# Altium project Shuttler_AFE.PrjPCB
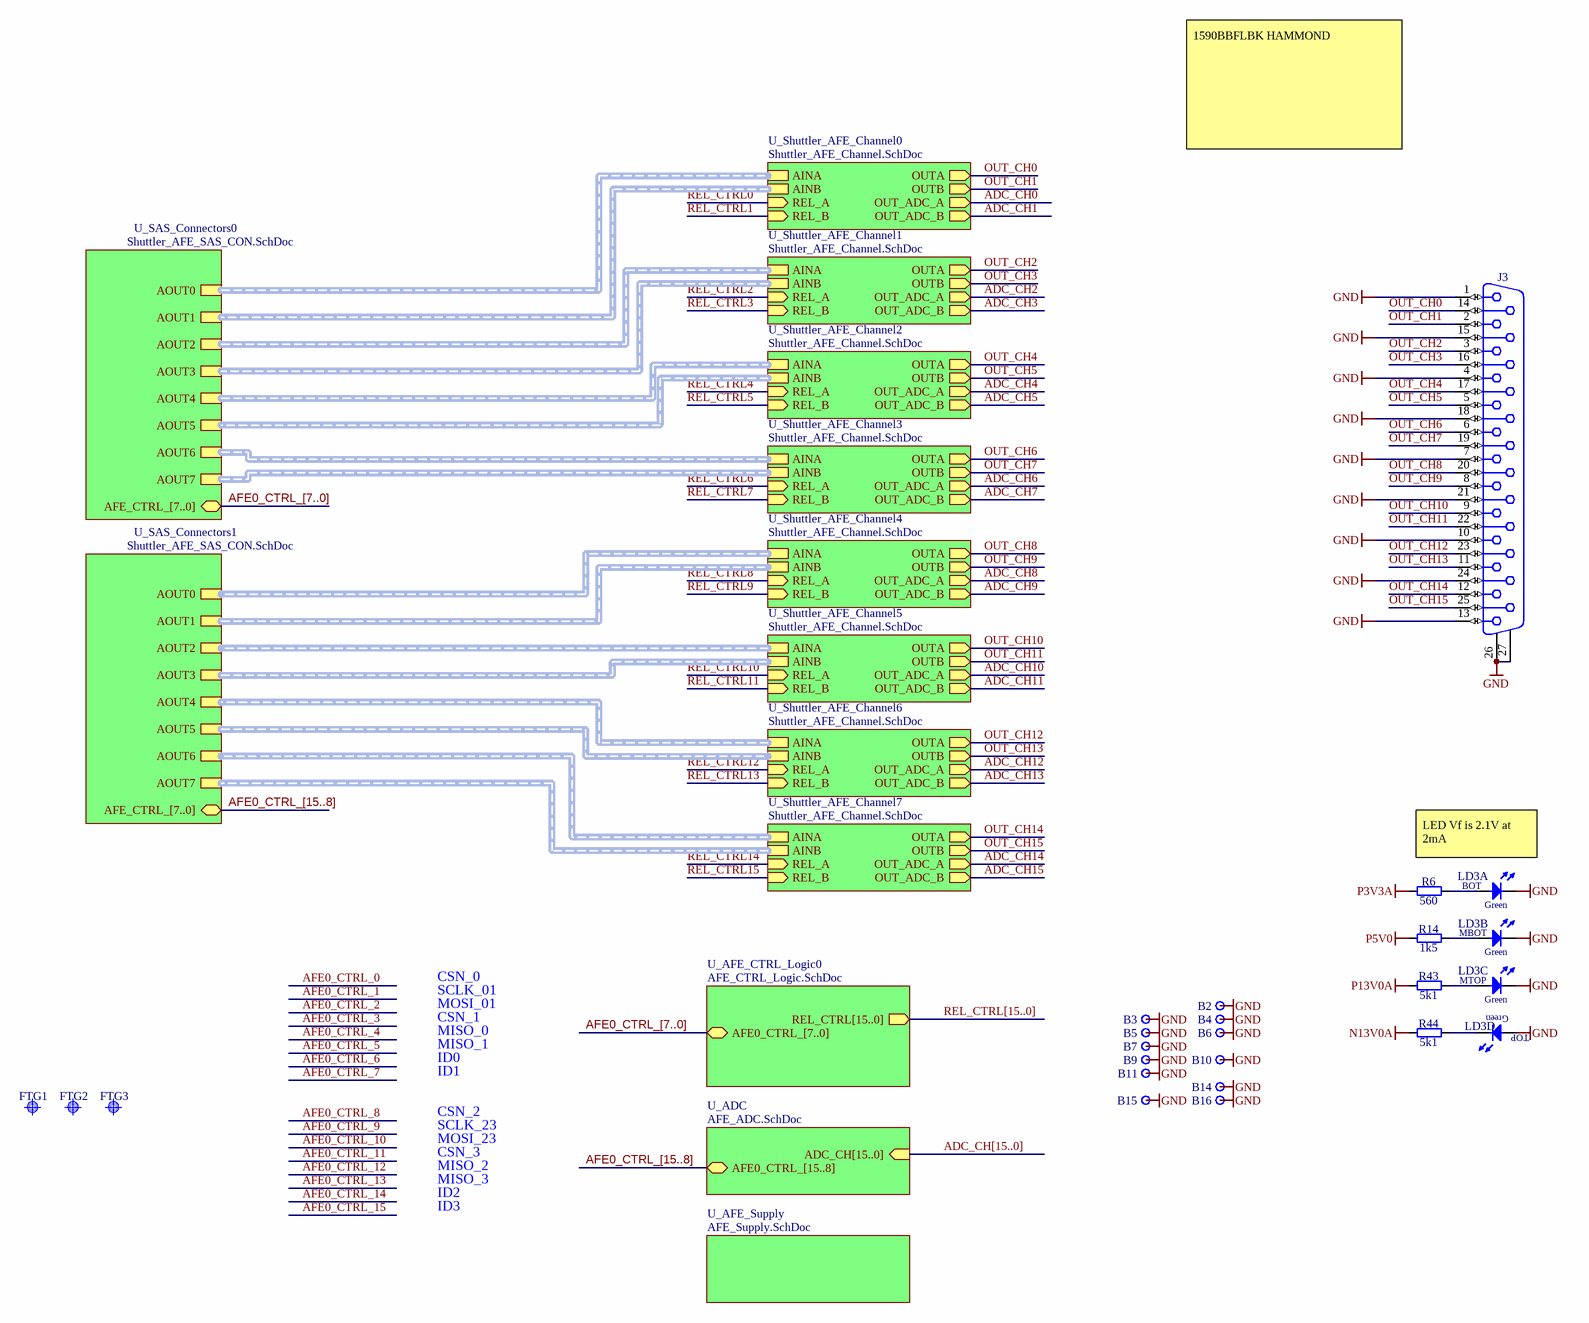
[diagram p0: Shuttler_AFE.SchDoc]
P_version: 1.3
3 sheets, 112 parts. Net scope: hierarchical (ports join the sheet entries above them; power ports are global).
Board file: Shuttler_AFE.PcbDoc
Sheets:
  Shuttler_AFE.SchDoc
    U_AFE_CTRL_Logic0 = AFE_CTRL_Logic.SchDoc
    U_ADC = AFE_ADC.SchDoc

## Sheet Shuttler_AFE.SchDoc: Shuttler AFE
size 420 x 297 mm; Author: G.Kasprowicz; CompanyName: WUT ISE; DrawnBy: G.Kasprowicz; Organization: WUT ISE; Address1: PW ISE; Address2: Nowowiejska 15/19 00-665 Warsaw; Address3: gkasprow@gmail.com; DocumentNumber: 1; Revision: 1.3; SheetNumber: 1; SheetTotal: 6; ModifiedBy: -; CheckedDate: -; Title2: TOP; DivGrp: WUT ISE; Designer: G.Kasprowicz; ModifiedDate: -; ProjectName: Sensor Box

### Parts
B2  Plated Hole  [MTG270_500]  (value not drawn)  (no BOM)
B3  Plated Hole  [MTG270_500]  (value not drawn)  (no BOM)
B4  Plated Hole  [MTG270_500]  (value not drawn)  (no BOM)
B5  Plated Hole  [MTG270_500]  (value not drawn)  (no BOM)
B6  Plated Hole  [MTG270_500]  (value not drawn)  (no BOM)
B7  Plated Hole  [MTG270_500]  (value not drawn)  (no BOM)
B9  Plated Hole  [MTG270_500]  (value not drawn)  (no BOM)
B10  Plated Hole  [MTG270_500]  (value not drawn)  (no BOM)
B11  Plated Hole  [MTG270_500]  (value not drawn)  (no BOM)
B14  Plated Hole  [MTG270_500]  (value not drawn)  (no BOM)
B15  Plated Hole  [MTG270_500]  (value not drawn)  (no BOM)
B16  Plated Hole  [MTG270_500]  (value not drawn)  (no BOM)
FTG1  Use only in PCB  [FIDUCIAL_TOP_S100-200]  (value not drawn)
FTG2  Use only in PCB  [FIDUCIAL_TOP_S100-200]  (value not drawn)
FTG3  Use only in PCB  [FIDUCIAL_TOP_S100-200]  (value not drawn)
J3  D-Sub  [TYCO_3-1634586-2]  (value not drawn)
LD3  Green  [LED_BIVAR_H485CGDL]  (value not drawn)  (parts A,B,C,D of 4)
R6  560  [RESC1608X55N]
R14  1k5  [RESC1608X55N]
R43  5k1  [RESC1608X55N]
R44  5k1  [RESC1608X55N]

### Sub-sheets
U_ADC = AFE_ADC.SchDoc: ADC_CH[15..0] (in), AFE0_CTRL_[15..8] (bidir)
U_AFE_CTRL_Logic0 = AFE_CTRL_Logic.SchDoc: REL_CTRL[15..0] (out), AFE0_CTRL_[7..0] (bidir)
U_AFE_Supply = AFE_Supply.SchDoc (file not in this document): no entries
U_SAS_Connectors0 = Shuttler_AFE_SAS_CON.SchDoc (file not in this document): AOUT4 (harness DIFF), AOUT0 (harness DIFF), AOUT1 (harness DIFF), AOUT2 (harness DIFF), AOUT6 (harness DIFF), AOUT7 (harness DIFF), AFE_CTRL_[7..0] (bidir), AOUT3 (harness DIFF), AOUT5 (harness DIFF)
U_SAS_Connectors1 = Shuttler_AFE_SAS_CON.SchDoc (file not in this document): AOUT4 (harness DIFF), AOUT0 (harness DIFF), AOUT1 (harness DIFF), AOUT2 (harness DIFF), AOUT6 (harness DIFF), AOUT7 (harness DIFF), AFE_CTRL_[7..0] (bidir), AOUT3 (harness DIFF), AOUT5 (harness DIFF)
U_Shuttler_AFE_Channel0 = Shuttler_AFE_Channel.SchDoc (file not in this document): AINA (harness DIFF), OUTA (out), AINB (harness DIFF), OUTB (out), REL_A (in), REL_B (in), OUT_ADC_A (out), OUT_ADC_B (out)
U_Shuttler_AFE_Channel1 = Shuttler_AFE_Channel.SchDoc (file not in this document): AINA (harness DIFF), OUTA (out), AINB (harness DIFF), OUTB (out), REL_A (in), REL_B (in), OUT_ADC_A (out), OUT_ADC_B (out)
U_Shuttler_AFE_Channel2 = Shuttler_AFE_Channel.SchDoc (file not in this document): AINA (harness DIFF), OUTA (out), AINB (harness DIFF), OUTB (out), REL_A (in), REL_B (in), OUT_ADC_A (out), OUT_ADC_B (out)
U_Shuttler_AFE_Channel3 = Shuttler_AFE_Channel.SchDoc (file not in this document): AINA (harness DIFF), OUTA (out), AINB (harness DIFF), OUTB (out), REL_A (in), REL_B (in), OUT_ADC_A (out), OUT_ADC_B (out)
U_Shuttler_AFE_Channel4 = Shuttler_AFE_Channel.SchDoc (file not in this document): AINA (harness DIFF), OUTA (out), AINB (harness DIFF), OUTB (out), REL_A (in), REL_B (in), OUT_ADC_A (out), OUT_ADC_B (out)
U_Shuttler_AFE_Channel5 = Shuttler_AFE_Channel.SchDoc (file not in this document): AINA (harness DIFF), OUTA (out), AINB (harness DIFF), OUTB (out), REL_A (in), REL_B (in), OUT_ADC_A (out), OUT_ADC_B (out)
U_Shuttler_AFE_Channel6 = Shuttler_AFE_Channel.SchDoc (file not in this document): AINA (harness DIFF), OUTA (out), AINB (harness DIFF), OUTB (out), REL_A (in), REL_B (in), OUT_ADC_A (out), OUT_ADC_B (out)
U_Shuttler_AFE_Channel7 = Shuttler_AFE_Channel.SchDoc (file not in this document): AINA (harness DIFF), OUTA (out), AINB (harness DIFF), OUTB (out), REL_A (in), REL_B (in), OUT_ADC_A (out), OUT_ADC_B (out)

### Nets
GND: B2.1 B3.1 B4.1 B5.1 B6.1 B7.1 B9.1 B10.1 B11.1 B14.1 B15.1 B16.1 J3.1 J3.4 J3.7 J3.10 J3.13 J3.15 J3.18 J3.21 J3.24 J3.26 J3.27 LD3.1(C) LD3.3(C) LD3.5(C) LD3.8(A)
N13V0A: R44.1
P3V3A: R6.1
P5V0: R14.1
P13V0A: R43.1
OUT_CH0: J3.14 ; sheet U_Shuttler_AFE_Channel0/OUTA
OUT_CH1: J3.2 ; sheet U_Shuttler_AFE_Channel0/OUTB
OUT_CH2: J3.3 ; sheet U_Shuttler_AFE_Channel1/OUTA
OUT_CH3: J3.16 ; sheet U_Shuttler_AFE_Channel1/OUTB
OUT_CH4: J3.17 ; sheet U_Shuttler_AFE_Channel2/OUTA
OUT_CH5: J3.5 ; sheet U_Shuttler_AFE_Channel2/OUTB
OUT_CH6: J3.6 ; sheet U_Shuttler_AFE_Channel3/OUTA
OUT_CH7: J3.19 ; sheet U_Shuttler_AFE_Channel3/OUTB
OUT_CH8: J3.20 ; sheet U_Shuttler_AFE_Channel4/OUTA
OUT_CH9: J3.8 ; sheet U_Shuttler_AFE_Channel4/OUTB
OUT_CH10: J3.9 ; sheet U_Shuttler_AFE_Channel5/OUTA
OUT_CH11: J3.22 ; sheet U_Shuttler_AFE_Channel5/OUTB
OUT_CH12: J3.23 ; sheet U_Shuttler_AFE_Channel6/OUTA
OUT_CH13: J3.11 ; sheet U_Shuttler_AFE_Channel6/OUTB
OUT_CH14: J3.12 ; sheet U_Shuttler_AFE_Channel7/OUTA
OUT_CH15: J3.25 ; sheet U_Shuttler_AFE_Channel7/OUTB
NetLD3_2: LD3.2(A) R6.2
NetLD3_4: LD3.4(A) R14.2
NetLD3_6: LD3.6(A) R43.2
NetLD3_7: LD3.7(C) R44.2

### Buses and harness runs
bus ADC_CH[15..0] = sheet U_ADC/ADC_CH[15..0]
bus AFE0_CTRL_[7..0] = sheet U_AFE_CTRL_Logic0/AFE0_CTRL_[7..0]
bus AFE0_CTRL_[7..0] = sheet U_SAS_Connectors0/AFE_CTRL_[7..0]
bus AFE0_CTRL_[15..8] = sheet U_ADC/AFE0_CTRL_[15..8]
bus AFE0_CTRL_[15..8] = sheet U_SAS_Connectors1/AFE_CTRL_[7..0]
bus REL_CTRL[15..0] = sheet U_AFE_CTRL_Logic0/REL_CTRL[15..0]
harness sheet U_SAS_Connectors0/AOUT0 = sheet U_Shuttler_AFE_Channel0/AINA
harness sheet U_SAS_Connectors0/AOUT1 = sheet U_Shuttler_AFE_Channel0/AINB
harness sheet U_SAS_Connectors0/AOUT2 = sheet U_Shuttler_AFE_Channel1/AINA
harness sheet U_SAS_Connectors0/AOUT3 = sheet U_Shuttler_AFE_Channel1/AINB
harness sheet U_SAS_Connectors0/AOUT4 = sheet U_Shuttler_AFE_Channel2/AINA
harness sheet U_SAS_Connectors0/AOUT5 = sheet U_Shuttler_AFE_Channel2/AINB
harness sheet U_SAS_Connectors0/AOUT6 = sheet U_Shuttler_AFE_Channel3/AINA
harness sheet U_SAS_Connectors0/AOUT7 = sheet U_Shuttler_AFE_Channel3/AINB
harness sheet U_SAS_Connectors1/AOUT0 = sheet U_Shuttler_AFE_Channel4/AINA
harness sheet U_SAS_Connectors1/AOUT1 = sheet U_Shuttler_AFE_Channel4/AINB
harness sheet U_SAS_Connectors1/AOUT2 = sheet U_Shuttler_AFE_Channel5/AINA
harness sheet U_SAS_Connectors1/AOUT3 = sheet U_Shuttler_AFE_Channel5/AINB
harness sheet U_SAS_Connectors1/AOUT4 = sheet U_Shuttler_AFE_Channel6/AINA
harness sheet U_SAS_Connectors1/AOUT5 = sheet U_Shuttler_AFE_Channel6/AINB
harness sheet U_SAS_Connectors1/AOUT6 = sheet U_Shuttler_AFE_Channel7/AINA
harness sheet U_SAS_Connectors1/AOUT7 = sheet U_Shuttler_AFE_Channel7/AINB

### Notes on the sheet
- 1590BBFLBK HAMMOND
- LED Vf is 2.1V at 2mA
- CSN_0
- SCLK_01
- MISO_0
- CSN_1
- MISO_1
- ID0
- MOSI_01
- ID1
- CSN_2
- SCLK_23
- MOSI_23
- MISO_2
- CSN_3
- MISO_3
- ID2
- ID3
- Project/Equipment
- Document
- Designer
- Drawn by
- Check.by
- Copyright WUT ISE 2018.
  This documentation describes Open Hardware and is licensed under the CERN OHL v.1.1. You may redistribute and modify this documentation under the terms of the CERN OHL v.1.1. (http://ohwr.org/CERNOHL). This documentation is distributed WITHOUT ANY EXPRESS OR IMPLIED WARRANTY, INCLUDING OF MERCHANTABILITY, SATISFACTORY QUALITY AND FITNESS FOR A PARTICULAR PURPOSE. Please see the CERN OHL v.1.1 for applicable conditions.
- Contact
- File
- Last Mod.
- Print Date
- Sheet
- Size
- A3
- of
- Rev
- (in symbol LED_BIVAR_H485CGDL, part A) BOT
- (in symbol LED_BIVAR_H485CGDL, part B) MBOT
- (in symbol LED_BIVAR_H485CGDL, part C) MTOP
- (in symbol LED_BIVAR_H485CGDL, part D) TOP

### Library data of the parts
B2-B7 B9-B11 B14-B16 = PLATED_HOLE2.7_PAD5.0: Single Terminal Socket; Part Description: Plated Through Hole: Hole Dia.=2.7mm Pad Dia.=5.0mm; Mounted: No; Part Number: PLATED_HOLE2.7_PAD5.0; Component Type: Standard (No BOM); Pin Count: 1; Family: Plated Hole; Socket: No; SMD: No; Sense: No; Status: None; ComponentHeight: 0mm; HelpURL: Undefined; Author: CERN DEM JMW; CreateDate: 27.09.2011; LatestRevisionDate: 27.09.2011; PackageDescription: Plated Through Hole: Hole Dia.=2.7mm Pad Dia.=5.0mm
FTG1-FTG3 = FIDUCIAL_TARGET_S100-200: Fiducial Target; Part Description: Square Fiducial Target, Top Layer, 1.0mm, Top Solder 2.0mm, Keepout =2.0mm; Mounted: No; Table: Pads; Part Number: FIDUCIAL_TARGET_S100-200; Component Kind: Standard (No BOM); Component Type: Standard (No BOM); Pin Count: 1; Family: Fiducial; Socket: No; SMD: Yes; Status: None; ComponentHeight: 0mm; Author: CERN DEM JLC; CreateDate: 9/2/2010; LatestRevisionDate: 4/4/2012; PackageDescription: Square Fiducial Target, Top Layer, 1.0mm, Top Solder 2.0mm, Keepout =2.0mm
J3 = TYCO_3-1634586-2: Connector D-sub 25 Female; Part Description: Right Angle 25 Female Contacts D-SUB Connector With Boardlock and 4-40 UNC Screwlocks; Manufacturer: TYCO ELECTRONICS; PressFit: No; Part Number: TYCO_3-1634586-2; Component Kind: Standard; Component Type: Standard; Pin Count: 27; Family: D-Sub; Mounted: Yes; Socket: No; SMD: No; Sense: No; Status: None; Manufacturer Part Number: 3-1634586-2; ComponentHeight: 13.57mm; HelpURL: \\cern.ch\dfs\Applications\Altium\Datasheets\TYCO_3-1634586-2.pdf; Author: CERN DEM JLC; CreateDate: 16.01.2013; LatestRevisionDate: 16.01.2013
LD3 = LED_BIVAR_H485CGDL: LED x4 Green 1C2A-BOT_3C4A_5C6A_7C8A-TOP; Part Description: Quad-Level 2mm Green LED, PCB Edge Mounting; Manufacturer: BIVAR; PressFit: No; Bonding: No; Part Number: LED_BIVAR_H485CGDL; Component Kind: Standard; Component Type: Standard; Color: Green; PackageDescription: Quad-Level 2mm Green, PCB Edge Mounting  BIVAR H485CHDL; Manufacturer Part Number: H485CGDL; Pin Count: 8; Mounted: Yes; Socket: No; SMD: No; Sense: No; ComponentHeight: 11.3mm; HelpURL: \\cern.ch\dfs\Applications\Altium\Datasheets\LED_BIVAR_H485CGDL.pdf; Author: CERN DEM JLC; CreateDate: 04.06.2012; LatestRevisionDate: 04.06.2012
R6 = R0603_560R_1%_0.1W_100PPM: Resistor - 1%; Part Description: General Purpose Thick Film Chip Resistor; Manufacturer: GENERIC; Manufacturer1 Part Number: NRC06F5600TRF; Power: 0.1W; TC: ±100ppm/°C; PressFit: No; Part Number: R0603_560R_1%_0.1W_100PPM; Component Kind: Standard; Component Type: Standard; Pin Count: 2; Value: 560; Status: Preferred; Tolerance: ±1%; Manufacturer Part Number: R0603_560R_1%_0.1W_100PPM; Case: 0603; Mounted: Yes; Sense: No; Socket: No; SMD: Yes; Manufacturer1 Example: NIC COMPONENT; Manufacturer1 ComponentHeight: 0.55mm; HelpURL: \\cern.ch\dfs\Applications\Altium\Datasheets\R0603_NIC_NRC.pdf; Author: CERN DEM JLC; CreateDate: 03.12.2007; LatestRevisionDate: 13.03.2008
R14 = R0603_1K5_1%_0.1W_100PPM: Resistor - 1%; Part Description: General Purpose Thick Film Chip Resistor; Manufacturer: GENERIC; Manufacturer1 Part Number: NRC06F1501TRF; Power: 0.1W; TC: ±100ppm/°C; PressFit: No; Part Number: R0603_1K5_1%_0.1W_100PPM; Component Kind: Standard; Component Type: Standard; Pin Count: 2; Value: 1k5; Status: Preferred; Tolerance: ±1%; Manufacturer Part Number: R0603_1K5_1%_0.1W_100PPM; Case: 0603; Mounted: Yes; Sense: No; Socket: No; SMD: Yes; Manufacturer1 Example: NIC COMPONENT; Manufacturer1 ComponentHeight: 0.55mm; HelpURL: \\cern.ch\dfs\Applications\Altium\Datasheets\R0603_NIC_NRC.pdf; Author: CERN DEM JLC; CreateDate: 03.12.2007; LatestRevisionDate: 13.03.2008
R43 R44 = R0603_5k1_1%_0.1W_100PPM: Resistor - 1%; Part Description: General Purpose Thick Film Chip Resistor; Manufacturer: GENERIC; Manufacturer1 Part Number: NRC06F5101TRF; Power: 0.1W; TC: ±100ppm/°C; PressFit: No; Part Number: R0603_5K1_1%_0.1W_100PPM; Component Kind: Standard; Component Type: Standard; Pin Count: 2; Value: 5k1; Status: Preferred; Tolerance: ±1%; Manufacturer Part Number: R0603_5K1_1%_0.1W_100PPM; Case: 0603; Mounted: Yes; Sense: No; Socket: No; SMD: Yes; Manufacturer1 Example: NIC COMPONENT; Manufacturer1 ComponentHeight: 0.55mm; HelpURL: \\cern.ch\dfs\Applications\Altium\Datasheets\R0603_NIC_NRC.pdf; Author: CERN DEM JLC; CreateDate: 03.12.2007; LatestRevisionDate: 13.03.2008

## Sheet AFE_CTRL_Logic.SchDoc: Shuttler AFE
size 420 x 297 mm; Author: G.Kasprowicz; CompanyName: WUT ISE; DrawnBy: G.Kasprowicz; Organization: WUT ISE; Address1: PW ISE; Address2: Nowowiejska 15/19 00-665 Warsaw; Address3: gkasprow@gmail.com; DocumentNumber: 3; Revision: 1.3; SheetNumber: 3; SheetTotal: 6; ModifiedBy: -; CheckedDate: -; Title2: Control & logic; DivGrp: WUT ISE; Designer: G.Kasprowicz; ModifiedDate: -; ProjectName: Sensor Box
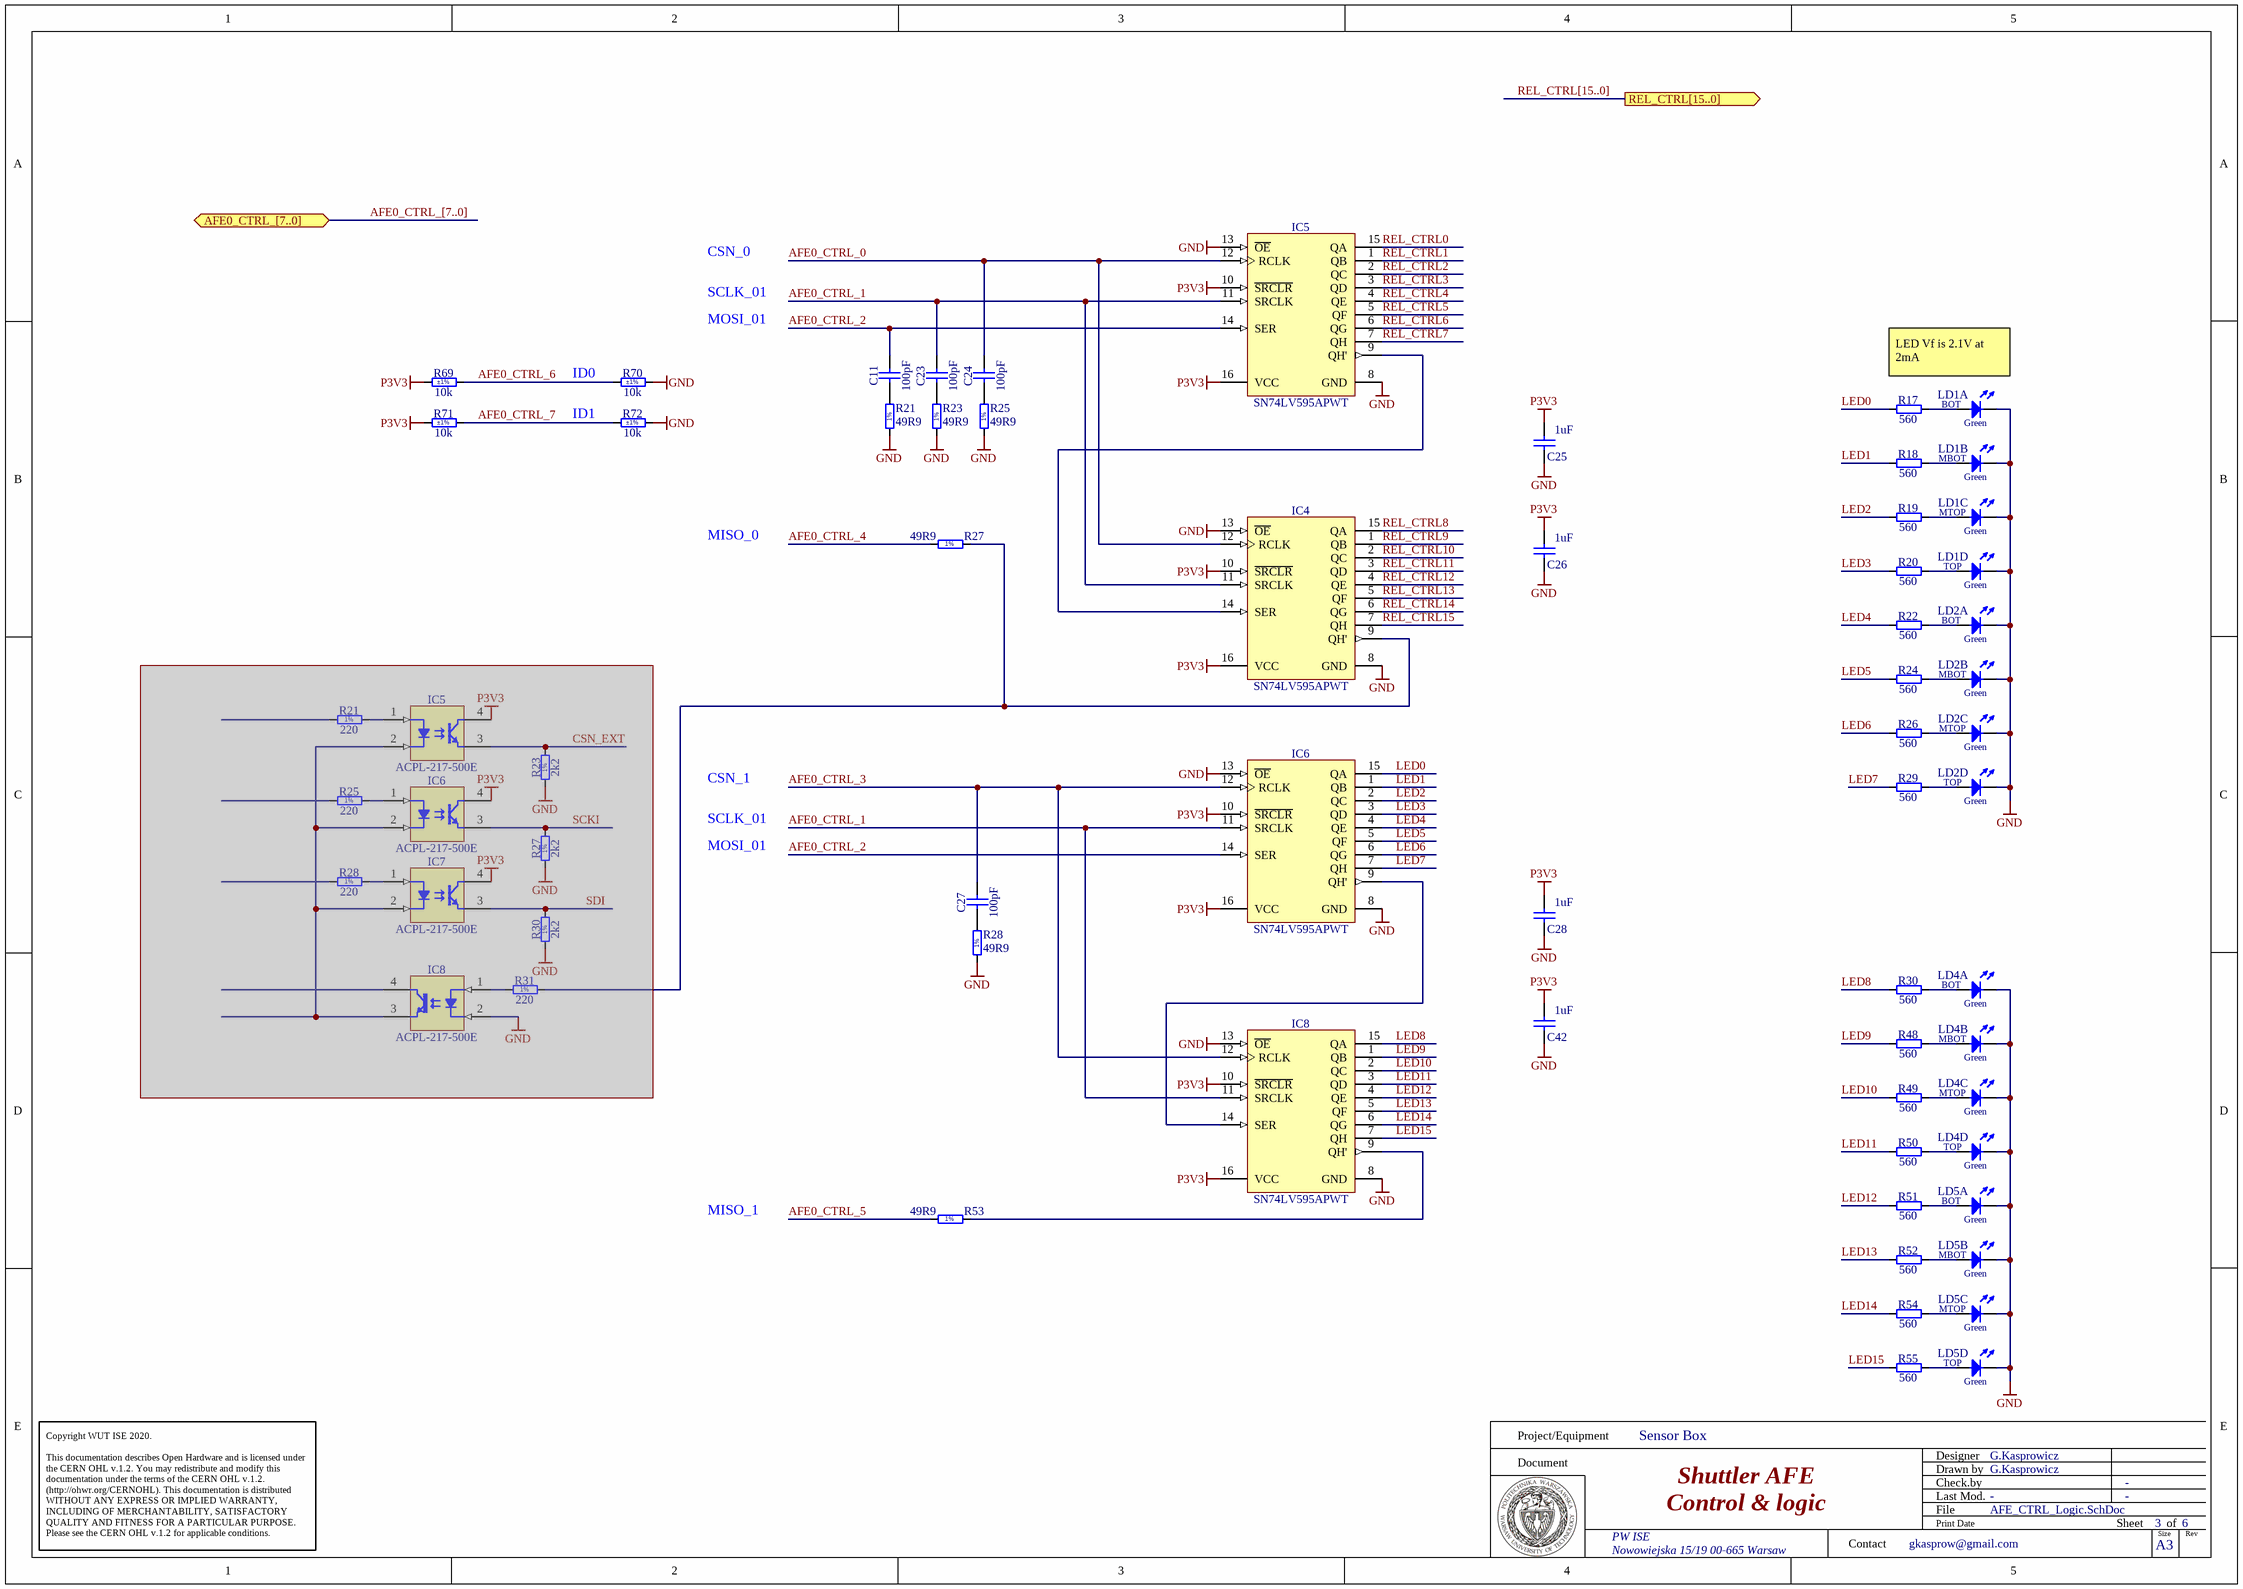
[diagram p1: AFE_CTRL_Logic.SchDoc]

### Parts
(Parts that share a designator on the sheet are numbered #1, #2 ... from top to bottom, then left to right.)
C11  100pF  [CAPC1005X55N]
C23  100pF  [CAPC1005X55N]
C24  100pF  [CAPC1005X55N]
C25  1uF  [CAPC1608X87N]
C26  1uF  [CAPC1608X87N]
C27  100pF  [CAPC1005X55N]
C28  1uF  [CAPC1608X87N]
C42  1uF  [CAPC1608X87N]
IC4  SN74LV595APWT  [SOP65P640X120-16N]
IC5#1  SN74LV595APWT  [SOP65P640X120-16N]
IC5#2  ACPL-217-500E  [SOIC127P700X242-4N]  (masked out: inside a compile mask, not in the netlist)
IC6#1  SN74LV595APWT  [SOP65P640X120-16N]
IC6#2  ACPL-217-500E  [SOIC127P700X242-4N]  (masked out: inside a compile mask, not in the netlist)
IC7#1  ACPL-217-500E  [SOIC127P700X242-4N]  (masked out: inside a compile mask, not in the netlist)
IC8#1  ACPL-217-500E  [SOIC127P700X242-4N]  (masked out: inside a compile mask, not in the netlist)
IC8#2  SN74LV595APWT  [SOP65P640X120-16N]
LD1  Green  [LED_BIVAR_H485CGDL]  (value not drawn)  (parts A,B,C,D of 4)
LD2  Green  [LED_BIVAR_H485CGDL]  (value not drawn)  (parts A,B,C,D of 4)
LD4  Green  [LED_BIVAR_H485CGDL]  (value not drawn)  (parts A,B,C,D of 4)
LD5  Green  [LED_BIVAR_H485CGDL]  (value not drawn)  (parts A,B,C,D of 4)
R17  560  [RESC1608X55N]
R18  560  [RESC1608X55N]
R19  560  [RESC1608X55N]
R20  560  [RESC1608X55N]
R21#1  49R9  [RESC1005X40N]
R21#2  220  [RESC1608X55N]  (masked out: inside a compile mask, not in the netlist)
R22  560  [RESC1608X55N]
R23#1  49R9  [RESC1005X40N]
R23#2  2k2  [RESC1005X40N]  (masked out: inside a compile mask, not in the netlist)
R24  560  [RESC1608X55N]
R25#1  49R9  [RESC1005X40N]
R25#2  220  [RESC1608X55N]  (masked out: inside a compile mask, not in the netlist)
R26  560  [RESC1608X55N]
R27#1  49R9  [RESC1005X40N]
R27#2  2k2  [RESC1005X40N]  (masked out: inside a compile mask, not in the netlist)
R28#1  220  [RESC1608X55N]  (masked out: inside a compile mask, not in the netlist)
R28#2  49R9  [RESC1005X40N]
R29  560  [RESC1608X55N]
R30#1  2k2  [RESC1005X40N]  (masked out: inside a compile mask, not in the netlist)
R30#2  560  [RESC1608X55N]
R31#1  220  [RESC1608X55N]  (masked out: inside a compile mask, not in the netlist)
R48  560  [RESC1608X55N]
R49  560  [RESC1608X55N]
R50  560  [RESC1608X55N]
R51  560  [RESC1608X55N]
R52  560  [RESC1608X55N]
R53  49R9  [RESC1005X40N]
R54  560  [RESC1608X55N]
R55  560  [RESC1608X55N]
R69  10k  Tolerance: ±1%  [RESC1005X40N]
R70  10k  Tolerance: ±1%  [RESC1005X40N]
R71  10k  Tolerance: ±1%  [RESC1005X40N]
R72  10k  Tolerance: ±1%  [RESC1005X40N]

### Ports
AFE0_CTRL_[7..0] (bidir), REL_CTRL[15..0] (out)

### Nets
GND: C25.1 C26.1 C28.1 C42.1 IC4.8(GND) IC4.13(~{OE}) IC5#1.8(GND) IC5#1.13(~{OE}) IC6#1.8(GND) IC6#1.13(~{OE}) IC8#2.8(GND) IC8#2.13(~{OE}) LD1.1(C) LD1.3(C) LD1.5(C) LD1.7(C) LD2.1(C) LD2.3(C) LD2.5(C) LD2.7(C) LD4.1(C) LD4.3(C) LD4.5(C) LD4.7(C) LD5.1(C) LD5.3(C) LD5.5(C) LD5.7(C) R21#1.1 R23#1.1 R25#1.1 R28#2.1 R70.2 R72.2
P3V3: C25.2 C26.2 C28.2 C42.2 IC4.10(~{SRCLR}) IC4.16(VCC) IC5#1.10(~{SRCLR}) IC5#1.16(VCC) IC6#1.10(~{SRCLR}) IC6#1.16(VCC) IC8#2.10(~{SRCLR}) IC8#2.16(VCC) R69.1 R71.1
AFE0_CTRL_0: C24.2 IC4.12(RCLK) IC5#1.12(RCLK)
AFE0_CTRL_1: C23.2 IC4.11(SRCLK) IC5#1.11(SRCLK) IC6#1.11(SRCLK) IC8#2.11(SRCLK)
AFE0_CTRL_2: C11.2 IC5#1.14(SER) IC6#1.14(SER)
AFE0_CTRL_3: C27.2 IC6#1.12(RCLK) IC8#2.12(RCLK)
AFE0_CTRL_4: R27#1.1
AFE0_CTRL_5: R53.1
AFE0_CTRL_6: R69.2 R70.1
AFE0_CTRL_7: R71.2 R72.1
LED0: IC6#1.15(QA) R17.1
LED1: IC6#1.1(QB) R18.1
LED2: IC6#1.2(QC) R19.1
LED3: IC6#1.3(QD) R20.1
LED4: IC6#1.4(QE) R22.1
LED5: IC6#1.5(QF) R24.1
LED6: IC6#1.6(QG) R26.1
LED7: IC6#1.7(QH) R29.1
LED8: IC8#2.15(QA) R30#2.1
LED9: IC8#2.1(QB) R48.1
LED10: IC8#2.2(QC) R49.1
LED11: IC8#2.3(QD) R50.1
LED12: IC8#2.4(QE) R51.1
LED13: IC8#2.5(QF) R52.1
LED14: IC8#2.6(QG) R54.1
LED15: IC8#2.7(QH) R55.1
REL_CTRL0: IC5#1.15(QA)
REL_CTRL1: IC5#1.1(QB)
REL_CTRL2: IC5#1.2(QC)
REL_CTRL3: IC5#1.3(QD)
REL_CTRL4: IC5#1.4(QE)
REL_CTRL5: IC5#1.5(QF)
REL_CTRL6: IC5#1.6(QG)
REL_CTRL7: IC5#1.7(QH)
REL_CTRL8: IC4.15(QA)
REL_CTRL9: IC4.1(QB)
REL_CTRL10: IC4.2(QC)
REL_CTRL11: IC4.3(QD)
REL_CTRL12: IC4.4(QE)
REL_CTRL13: IC4.5(QF)
REL_CTRL14: IC4.6(QG)
REL_CTRL15: IC4.7(QH)
NetC11_1: C11.1 R21#1.2
NetC23_1: C23.1 R23#1.2
NetC24_1: C24.1 R25#1.2
NetC27_1: C27.1 R28#2.2
NetIC4_9: IC4.9(QH') R27#1.2
NetIC4_14: IC4.14(SER) IC5#1.9(QH')
NetIC6#1_9: IC6#1.9(QH') IC8#2.14(SER)
NetIC8#2_9: IC8#2.9(QH') R53.2
NetLD1_2: LD1.2(A) R17.2
NetLD1_4: LD1.4(A) R18.2
NetLD1_6: LD1.6(A) R19.2
NetLD1_8: LD1.8(A) R20.2
NetLD2_2: LD2.2(A) R22.2
NetLD2_4: LD2.4(A) R24.2
NetLD2_6: LD2.6(A) R26.2
NetLD2_8: LD2.8(A) R29.2
NetLD4_2: LD4.2(A) R30#2.2
NetLD4_4: LD4.4(A) R48.2
NetLD4_6: LD4.6(A) R49.2
NetLD4_8: LD4.8(A) R50.2
NetLD5_2: LD5.2(A) R51.2
NetLD5_4: LD5.4(A) R52.2
NetLD5_6: LD5.6(A) R54.2
NetLD5_8: LD5.8(A) R55.2

### Buses and harness runs
bus AFE0_CTRL_[7..0] = port AFE0_CTRL_[7..0]
bus REL_CTRL[15..0] = port REL_CTRL[15..0]

### Notes on the sheet
- CSN_0
- SCLK_01
- MOSI_01
- (near R70) ID0
- LED Vf is 2.1V at 2mA
- ID1
- MISO_0
- CSN_1
- MISO_1
- Project/Equipment
- Document
- Designer
- Drawn by
- Check.by
- Copyright WUT ISE 2020.
  This documentation describes Open Hardware and is licensed under the CERN OHL v.1.2. You may redistribute and modify this documentation under the terms of the CERN OHL v.1.2. (http://ohwr.org/CERNOHL). This documentation is distributed WITHOUT ANY EXPRESS OR IMPLIED WARRANTY, INCLUDING OF MERCHANTABILITY, SATISFACTORY QUALITY AND FITNESS FOR A PARTICULAR PURPOSE. Please see the CERN OHL v.1.2 for applicable conditions.
- Contact
- File
- Last Mod.
- Print Date
- Sheet
- Size
- A3
- of
- Rev
- (in symbol LED_BIVAR_H485CGDL, part A) BOT
- (in symbol LED_BIVAR_H485CGDL, part B) MBOT
- (in symbol LED_BIVAR_H485CGDL, part C) MTOP
- (in symbol LED_BIVAR_H485CGDL, part D) TOP
- (in symbol R0402_2K2_1%_0.0625W_100PPM) 1%
- (in symbol R0402_49R9_1%_0.0625W_100PPM) 1%
- (in symbol R0603_220R_1%_0.1W_100PPM) 1%

### Library data of the parts
C11 C23 C24 C27 = CC0402_100PF_50V_5%_C0G: Non-polarised capacitor; Part Description: SMD Multilayer Chip Ceramic Capacitor; Manufacturer: GENERIC; Manufacturer1 Part Number: C0402C101J5GACTU; Voltage: 50V; TC: C0G/NP0; Tolerance: ±5%; Part Number: CC0402_100PF_50V_5%_C0G; Component Kind: Standard; Component Type: Standard; Pin Count: 2; Value: 100pF; Status: Preferred; Manufacturer Part Number: CC0402_100PF_50V_5%_C0G; Case: 0402; Mounted: Yes; Socket: No; SMD: Yes; Sense: No; Manufacturer1 Example: KEMET; Manufacturer1 ComponentHeight: 0.55mm; HelpURL: \\cern.ch\dfs\Applications\Altium\Datasheets\CC0402_C0G_KEMET_(Commercial Grade).pdf; Author: CERN DEM JLC; CreateDate: 03.12.2007; LatestRevisionDate: 22.04.2015
C25 C26 C28 C42 = CC0603_1UF_16V_10%_X7R: Non-polarised capacitor; Part Description: SMD Multilayer Chip Ceramic Capacitor; Manufacturer: GENERIC; Manufacturer1 Part Number: 223878615663; Voltage: 16V; TC: X7R; Tolerance: ±10%; Part Number: CC0603_1UF_16V_10%_X7R; Component Kind: Standard; Component Type: Standard; Pin Count: 2; Value: 1uF; Status: None; Manufacturer Part Number: CC0603_1UF_16V_10%_X7R; Case: 0603; Mounted: Yes; Socket: No; SMD: Yes; Sense: No; Manufacturer1 Example: YAGEO PHYCOMP; Manufacturer1 ComponentHeight: 0.9mm; HelpURL: \\cern.ch\dfs\Applications\Altium\Datasheets\CC0603_X7R_PHYCOMP.pdf; Author: CERN DEM JLC; CreateDate: 03.12.2007; LatestRevisionDate: 17.04.2015
IC4 IC5#1 IC6#1 IC8#2 = SN74LV595APWT: 8-Bit Shift Register With 3-State Output Register; Manufacturer: TEXAS INSTRUMENTS; PressFit: No; Bonding: No; Part Number: SN74LV595APWT; Component Kind: Standard; Component Type: Standard; Device: SN74LV595APWT; PackageDescription: SOP, 0.65mm pitch; 16 pin, 4.40mm W X 5.00mm L X 1.20mm H body IPC Medium Density; Part Description: 8-Bit Shift Register With 3-State Output Register; Manufacturer Part Number: SN74LV595APWT; Pin Count: 16; Case: TSSOP16; Mounted: Yes; Socket: No; SMD: Yes; Sense: No; ComponentHeight: 1.2mm; Author: CERN DEM JLC; HelpURL: \\cern.ch\dfs\Applications\Altium\Datasheets\SN74LV595APWT.pdf; CreateDate: 10.05.2012; LatestRevisionDate: 10.05.2012
IC5#2 IC6#2 IC7#1 IC8#1 = ACPL-217-500E: Single Optocoupler; Part Description: DC Input, Half-Pitch Phototransistor Optocoupler; Manufacturer: AVAGO TECHNOLOGIES; PressFit: No; Bonding: No; Part Number: ACPL-217-500E; Component Kind: Standard; Component Type: Standard; Device: ACPL-217-500E; PackageDescription: SOIC, 1.27mm, pitch; 4 pin, 2.60mm W X 4.40mm L X 2.42mm H body, IPC Medium Density; Status: Not Recommended; Manufacturer Part Number: ACPL-217-500E; Pin Count: 4; Case: SOIC4; Mounted: Yes; Socket: No; SMD: Yes; Sense: No; ComponentHeight: 2.42mm; HelpURL: \\cern.ch\dfs\Applications\Altium\Datasheets\ACPL-217-500E.pdf; Author: CERN DEM JLC; CreateDate: 11.11.2014; LatestRevisionDate: 11.11.2014
LD1 LD2 LD4 LD5 = LED_BIVAR_H485CGDL: as LD3 on sheet Shuttler_AFE; Part Number: LED_BIVAR_H485CGDL; Component Kind: Standard; Component Type: Standard; Color: Green; PackageDescription: Quad-Level 2mm Green, PCB Edge Mounting  BIVAR H485CHDL; Manufacturer Part Number: H485CGDL; Pin Count: 8; Mounted: Yes; Socket: No; SMD: No; Sense: No; ComponentHeight: 11.3mm; HelpURL: \\cern.ch\dfs\Applications\Altium\Datasheets\LED_BIVAR_H485CGDL.pdf; Author: CERN DEM JLC; CreateDate: 04.06.2012; LatestRevisionDate: 04.06.2012
R17-R20 R22 R24 R26 R29 R30#2 R48-R52 R54 R55 = R0603_560R_1%_0.1W_100PPM: as R6 on sheet Shuttler_AFE; Part Number: R0603_560R_1%_0.1W_100PPM; Component Kind: Standard; Component Type: Standard; Pin Count: 2; Value: 560; Status: Preferred; Tolerance: ±1%; Manufacturer Part Number: R0603_560R_1%_0.1W_100PPM; Case: 0603; Mounted: Yes; Sense: No; Socket: No; SMD: Yes; Manufacturer1 Example: NIC COMPONENT; Manufacturer1 ComponentHeight: 0.55mm; HelpURL: \\cern.ch\dfs\Applications\Altium\Datasheets\R0603_NIC_NRC.pdf; Author: CERN DEM JLC; CreateDate: 03.12.2007; LatestRevisionDate: 13.03.2008
R21#1 R23#1 R25#1 R27#1 R28#2 R53 = R0402_49R9_1%_0.0625W_100PPM: Resistor - 1%; Part Description: General Purpose Thick Film Chip Resistor; Manufacturer: GENERIC; Manufacturer1 Part Number: 232270674999L or RC0402FR-0749R9L; TC: ±100ppm/°C; PressFit: No; Part Number: R0402_49R9_1%_0.0625W_100PPM; Component Kind: Standard; Component Type: Standard; Pin Count: 2; Value: 49R9; Status: Not Recommended; Power: 0.0625W; Tolerance: ±1%; Manufacturer Part Number: R0402_49R9_1%_0.0625W_100PPM; Case: 0402; Mounted: Yes; Sense: No; Socket: No; SMD: Yes; Manufacturer1 Example: YAGEO PHYCOMP; Manufacturer1 ComponentHeight: 0.4mm; HelpURL: \\cern.ch\dfs\Applications\Altium\Datasheets\R0402_Phycomp_RC0402.pdf; Author: CERN DEM JLC; CreateDate: 24.10.2012; LatestRevisionDate: 24.10.2012
R21#2 R25#2 R28#1 R31#1 = R0603_220R_1%_0.1W_100PPM: Resistor - 1%; Part Description: General Purpose Thick Film Chip Resistor; Manufacturer: GENERIC; Manufacturer1 Part Number: NRC06F2200TRF; Power: 0.1W; TC: ±100ppm/°C; Part Number: R0603_220R_1%_0.1W_100PPM; Component Kind: Standard; Component Type: Standard; Pin Count: 2; Value: 220; Status: Preferred; Tolerance: ±1%; Manufacturer Part Number: R0603_220R_1%_0.1W_100PPM; Case: 0603; Mounted: Yes; Sense: No; Socket: No; SMD: Yes; Manufacturer1 Example: NIC COMPONENT; Manufacturer1 ComponentHeight: 0.55mm; HelpURL: \\cern.ch\dfs\Applications\Altium\Datasheets\R0603_NIC_NRC.pdf; Author: CERN DEM JLC; CreateDate: 03.12.2007; LatestRevisionDate: 13.03.2008
R23#2 R27#2 R30#1 = R0402_2K2_1%_0.0625W_100PPM: Resistor - 1%; Part Description: General Purpose Thick Film Chip Resistor; Manufacturer: GENERIC; Manufacturer1 Part Number: 232270672202L; TC: ±100ppm/°C; PressFit: No; Part Number: R0402_2K2_1%_0.0625W_100PPM; Component Kind: Standard; Component Type: Standard; Pin Count: 2; Value: 2k2; Status: Not Recommended; Power: 0.0625W; Tolerance: ±1%; Manufacturer Part Number: R0402_2K2_1%_0.0625W_100PPM; Case: 0402; Mounted: Yes; Sense: No; Socket: No; SMD: Yes; Manufacturer1 Example: YAGEO PHYCOMP; Manufacturer1 ComponentHeight: 0.4mm; HelpURL: \\cern.ch\dfs\Applications\Altium\Datasheets\R0402_Phycomp_RC0402.pdf; Author: CERN DEM JLC; CreateDate: 03.12.2007; LatestRevisionDate: 17.10.2012
R69-R72 = R0402_10K_1%_0.0625W_100PPM: Resistor - 1%; Part Description: General Purpose Thick Film Chip Resistor; Manufacturer: GENERIC; Manufacturer1 Part Number: 232270671003L; TC: ±100ppm/°C; PressFit: No; Part Number: R0402_10K_1%_0.0625W_100PPM; Component Kind: Standard; Component Type: Standard; Pin Count: 2; Value: 10k; Status: Not Recommended; Power: 0.0625W; Manufacturer Part Number: R0402_10K_1%_0.0625W_100PPM; Case: 0402; Mounted: Yes; Sense: No; Socket: No; SMD: Yes; Manufacturer1 Example: YAGEO PHYCOMP; Manufacturer1 ComponentHeight: 0.4mm; HelpURL: \\cern.ch\dfs\Applications\Altium\Datasheets\R0402_Phycomp_RC0402.pdf; Author: CERN DEM JLC; CreateDate: 03.12.2007; LatestRevisionDate: 17.10.2012

## Sheet AFE_ADC.SchDoc: Shuttler AFE
size A4; Author: G.Kasprowicz; CompanyName: WUT ISE; DrawnBy: G.Kasprowicz; Organization: WUT ISE; Address1: PW ISE; Address2: Nowowiejska 15/19 00-665 Warsaw; Address3: gkasprow@gmail.com; DocumentNumber: 2; Revision: 1.3; SheetNumber: 2; SheetTotal: 6; ModifiedBy: -; CheckedDate: -; Title2: ADC; DivGrp: WUT ISE; Designer: G.Kasprowicz; ModifiedDate: -; ProjectName: Sensor Box
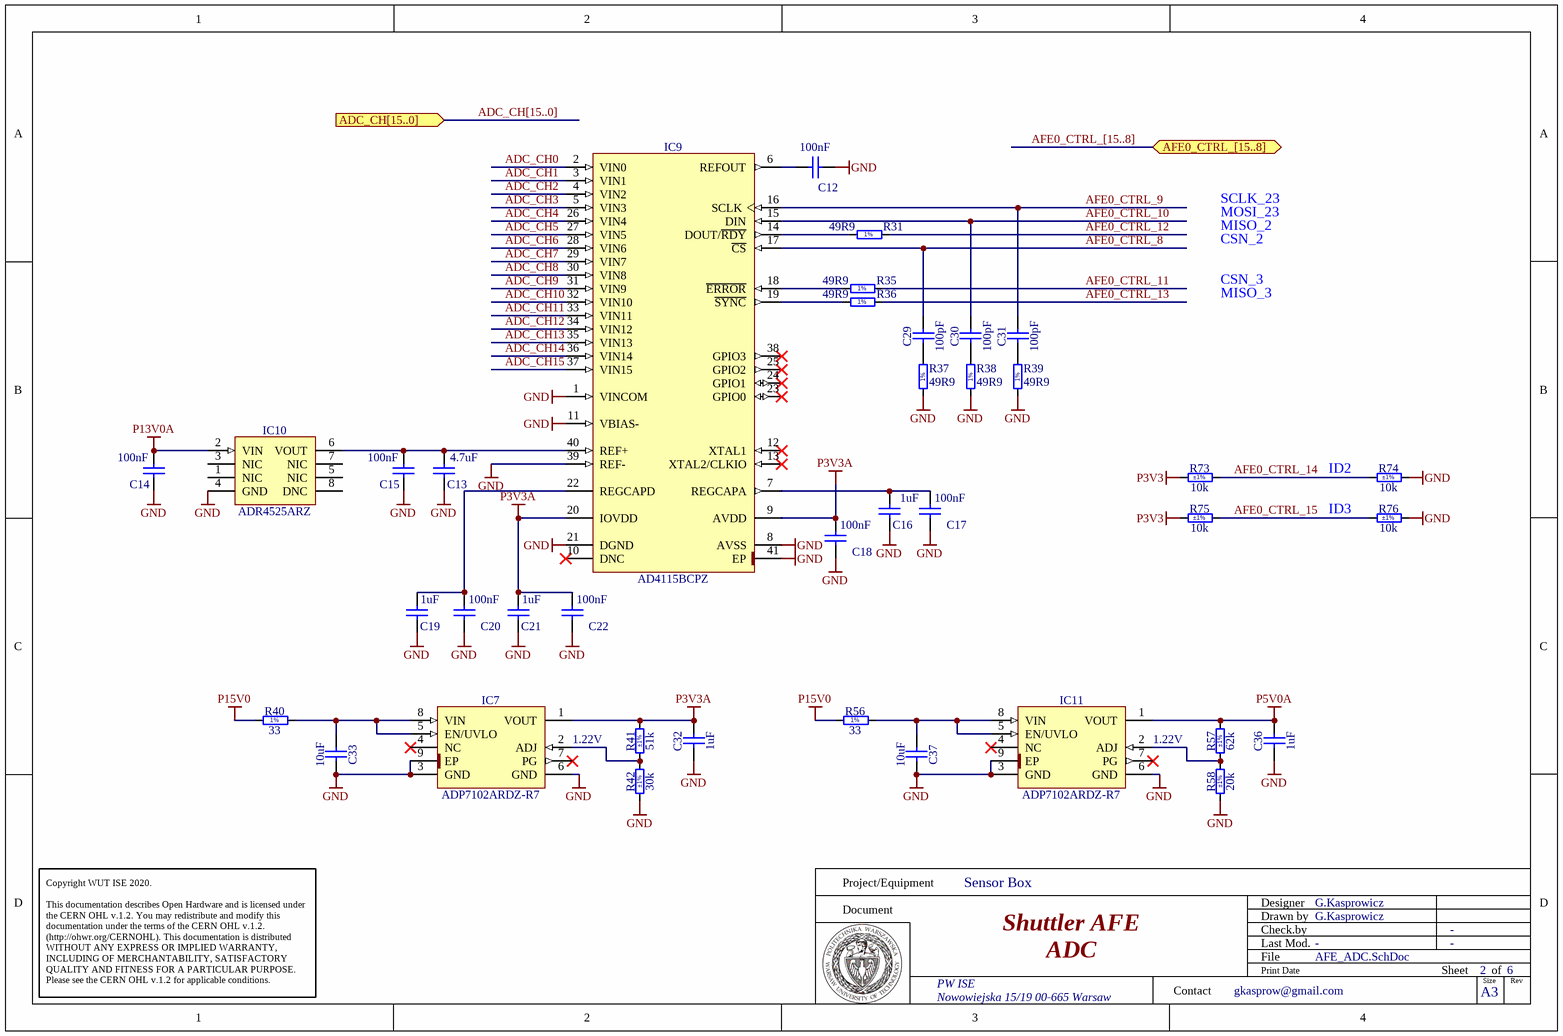
[diagram p2: AFE_ADC.SchDoc]

### Parts
(Parts that share a designator on the sheet are numbered #1, #2 ... from top to bottom, then left to right.)
C12  100nF  [CAPC1005X55N]
C13  4.7uF  [CAPC1608X90N]
C14  100nF  [CAPC1005X55N]
C15  100nF  [CAPC1005X55N]
C16  1uF  [CAPC1608X87N]
C17  100nF  [CAPC1005X55N]
C18  100nF  [CAPC1005X55N]
C19  1uF  [CAPC1608X87N]
C20  100nF  [CAPC1005X55N]
C21  1uF  [CAPC1608X87N]
C22  100nF  [CAPC1005X55N]
C29  100pF  [CAPC1005X55N]
C30  100pF  [CAPC1005X55N]
C31  100pF  [CAPC1005X55N]
C32  1uF  [CAPC1608X87N]
C33  10uF  [CAPC2012X135N]
C36  1uF  [CAPC1608X87N]
C37  10uF  [CAPC2012X135N]
IC7#2  ADP7102ARDZ-R7  [SOIC127P600X175-9N-R241X309]
IC9  AD4115BCPZ  [QFN50P600X600X100-41N-S470]
IC10  ADR4525ARZ  [SOIC127P600X175-8N]
IC11  ADP7102ARDZ-R7  [SOIC127P600X175-9N-R241X309]
R31#2  49R9  [RESC1005X40N]
R35  49R9  [RESC1005X40N]
R36  49R9  [RESC1005X40N]
R37  49R9  [RESC1005X40N]
R38  49R9  [RESC1005X40N]
R39  49R9  [RESC1005X40N]
R40  33  [RESC1005X40N]
R41  51k  Tolerance: ±1%  [RESC1005X40N]
R42  30k  Tolerance: ±1%  [RESC1005X40N]
R56  33  [RESC1005X40N]
R57  62k  Tolerance: ±1%  [RESC1005X40N]
R58  20k  Tolerance: ±1%  [RESC1005X40N]
R73  10k  Tolerance: ±1%  [RESC1005X40N]
R74  10k  Tolerance: ±1%  [RESC1005X40N]
R75  10k  Tolerance: ±1%  [RESC1005X40N]
R76  10k  Tolerance: ±1%  [RESC1005X40N]

### Ports
ADC_CH[15..0] (in), AFE0_CTRL_[15..8] (bidir)

### Nets
GND: C12.2 C13.1 C14.2 C15.2 C16.1 C17.2 C18.2 C19.1 C20.2 C21.1 C22.2 C32.1 C33.2 C36.1 C37.2 IC7#2.3(GND) IC7#2.6(GND) IC7#2.9(EP) IC9.1(VINCOM) IC9.8(AVSS) IC9.11(VBIAS-) IC9.21(DGND) IC9.39(REF-) IC9.41(EP) IC10.4(GND) IC11.3(GND) IC11.6(GND) IC11.9(EP) R37.1 R38.1 R39.1 R42.1 R58.1 R74.2 R76.2
P3V3: R73.1 R75.1
P3V3A: C18.1 C21.2 C22.1 C32.2 IC7#2.1(VOUT) IC9.9(AVDD) IC9.20(IOVDD) R41.2
P5V0A: C36.2 IC11.1(VOUT) R57.2
P13V0A: C14.1 IC10.2(VIN)
P15V0: R40.1 R56.1
ADC_CH0: IC9.2(VIN0)
ADC_CH1: IC9.3(VIN1)
ADC_CH2: IC9.4(VIN2)
ADC_CH3: IC9.5(VIN3)
ADC_CH4: IC9.26(VIN4)
ADC_CH5: IC9.27(VIN5)
ADC_CH6: IC9.28(VIN6)
ADC_CH7: IC9.29(VIN7)
ADC_CH8: IC9.30(VIN8)
ADC_CH9: IC9.31(VIN9)
ADC_CH10: IC9.32(VIN10)
ADC_CH11: IC9.33(VIN11)
ADC_CH12: IC9.34(VIN12)
ADC_CH13: IC9.35(VIN13)
ADC_CH14: IC9.36(VIN14)
ADC_CH15: IC9.37(VIN15)
AFE0_CTRL_8: C29.2 IC9.17(~{CS})
AFE0_CTRL_9: C31.2 IC9.16(SCLK)
AFE0_CTRL_10: C30.2 IC9.15(DIN)
AFE0_CTRL_11: R35.2
AFE0_CTRL_12: R31#2.2
AFE0_CTRL_13: R36.2
AFE0_CTRL_14: R73.2 R74.1
AFE0_CTRL_15: R75.2 R76.1
NetC12_1: C12.1 IC9.6(REFOUT)
NetC13_2: C13.2 C15.1 IC9.40(REF+) IC10.6(VOUT)
NetC16_2: C16.2 C17.1 IC9.7(REGCAPA)
NetC19_2: C19.2 C20.1 IC9.22(REGCAPD)
NetC29_1: C29.1 R37.2
NetC30_1: C30.1 R38.2
NetC31_1: C31.1 R39.2
NetC33_1: C33.1 IC7#2.5(EN/UVLO) IC7#2.8(VIN) R40.2
NetC37_1: C37.1 IC11.5(EN/UVLO) IC11.8(VIN) R56.2
NetIC7#2_2: IC7#2.2(ADJ) R41.1 R42.2
NetIC9_14: IC9.14(DOUT/~{RDY}) R31#2.1
NetIC9_18: IC9.18(~{ERROR}) R35.1
NetIC9_19: IC9.19(~{SYNC}) R36.1
NetIC11_2: IC11.2(ADJ) R57.1 R58.2

Not connected (* = marked no-connect by the designer): IC7#2 4(NC)* 7(PG)*; IC9 10(DNC)* 12(XTAL1)* 13(XTAL2/CLKIO)* 23(GPIO0)* 24(GPIO1)* 25(GPIO2)* 38(GPIO3)*; IC10 1(NIC) 3(NIC) 5(NIC) 7(NIC) 8(DNC); IC11 4(NC)* 7(PG)*

### Buses and harness runs
bus ADC_CH[15..0] = port ADC_CH[15..0]
bus AFE0_CTRL_[15..8] = port AFE0_CTRL_[15..8]

### Notes on the sheet
- MOSI_23
- MISO_2
- CSN_2
- SCLK_23
- CSN_3
- MISO_3
- (near R74) ID2
- ID3
- 1.22V
- Project/Equipment
- Document
- Designer
- Drawn by
- Check.by
- Copyright WUT ISE 2020.
  This documentation describes Open Hardware and is licensed under the CERN OHL v.1.2. You may redistribute and modify this documentation under the terms of the CERN OHL v.1.2. (http://ohwr.org/CERNOHL). This documentation is distributed WITHOUT ANY EXPRESS OR IMPLIED WARRANTY, INCLUDING OF MERCHANTABILITY, SATISFACTORY QUALITY AND FITNESS FOR A PARTICULAR PURPOSE. Please see the CERN OHL v.1.2 for applicable conditions.
- Contact
- File
- Last Mod.
- Print Date
- Sheet
- Size
- A3
- of
- Rev
- (in symbol R0402_33R_1%_0.0625W_100PPM) 1%
- (in symbol R0402_49R9_1%_0.0625W_100PPM) 1%

### Library data of the parts
C12 C14 C15 C17 C18 C20 C22 = CC0402_100NF_16V_10%_X5R: Non-polarised capacitor; Part Description: SMD Multilayer Chip Ceramic Capacitor; Manufacturer: GENERIC; Manufacturer1 Part Number: GRM155R61C104KA88D; Voltage: 16V; TC: X5R; Tolerance: ±10%; Part Number: CC0402_100NF_16V_10%_X5R; Component Kind: Standard; Component Type: Standard; Pin Count: 2; Value: 100nF; Status: None; Manufacturer Part Number: CC0402_100NF_16V_10%_X5R; Case: 0402; Mounted: Yes; Socket: No; SMD: Yes; Sense: No; Manufacturer1 Example: MURATA; Manufacturer1 ComponentHeight: 0.55mm; HelpURL: \\cern.ch\dfs\Applications\Altium\Datasheets\CC0402_X5R_MURATA_GRM.pdf; Author: CERN DEM JLC; CreateDate: 10.12.2013; LatestRevisionDate: 10.12.2013
C13 = CC0603_4.7UF_25V_10%_X5R: Non-polarised capacitor; Part Description: SMD Multilayer Chip Ceramic Capacitor; Manufacturer: GENERIC; Manufacturer1 Part Number: GRM188R61E475KE11D; Voltage: 25V; TC: X5R; Tolerance: ±10%; Part Number: CC0603_4.7UF_25V_10%_X5R; Component Kind: Standard; Component Type: Standard; Pin Count: 2; Value: 4.7uF; Status: None; Manufacturer Part Number: CC0603_4.7UF_25V_10%_X5R; Case: 0603; Mounted: Yes; Socket: No; SMD: Yes; Sense: No; Manufacturer1 Example: MURATA; Manufacturer1 ComponentHeight: 0.95mm; HelpURL: \\cern.ch\dfs\Applications\Altium\Datasheets\CC0603_MURATA_GRM188R61E475KE11D.pdf; Author: CERN DEM JLC; CreateDate: 10.11.2014; LatestRevisionDate: 10.11.2014
C16 C19 C21 = CC0603_1UF_16V_10%_X7R: as C25 on sheet AFE_CTRL_Logic; Part Number: CC0603_1UF_16V_10%_X7R; Component Kind: Standard; Component Type: Standard; Pin Count: 2; Value: 1uF; Status: None; Manufacturer Part Number: CC0603_1UF_16V_10%_X7R; Case: 0603; Mounted: Yes; Socket: No; SMD: Yes; Sense: No; Manufacturer1 Example: YAGEO PHYCOMP; Manufacturer1 ComponentHeight: 0.9mm; HelpURL: \\cern.ch\dfs\Applications\Altium\Datasheets\CC0603_X7R_PHYCOMP.pdf; Author: CERN DEM JLC; CreateDate: 03.12.2007; LatestRevisionDate: 17.04.2015
C29-C31 = CC0402_100PF_50V_5%_C0G: as C11 on sheet AFE_CTRL_Logic; Part Number: CC0402_100PF_50V_5%_C0G; Component Kind: Standard; Component Type: Standard; Pin Count: 2; Value: 100pF; Status: Preferred; Manufacturer Part Number: CC0402_100PF_50V_5%_C0G; Case: 0402; Mounted: Yes; Socket: No; SMD: Yes; Sense: No; Manufacturer1 Example: KEMET; Manufacturer1 ComponentHeight: 0.55mm; HelpURL: \\cern.ch\dfs\Applications\Altium\Datasheets\CC0402_C0G_KEMET_(Commercial Grade).pdf; Author: CERN DEM JLC; CreateDate: 03.12.2007; LatestRevisionDate: 22.04.2015
C32 C36 = CC0603_1UF_25V_10%_X7R: Non-polarised capacitor; Part Description: SMD Multilayer Chip Ceramic Capacitor; Manufacturer: GENERIC; Manufacturer1 Part Number: GRM188R71E105KA12D; Voltage: 25V; TC: X7R; Tolerance: ±10%; Part Number: CC0603_1UF_25V_10%_X7R; Component Kind: Standard; Component Type: Standard; Pin Count: 2; Value: 1uF; Status: None; Manufacturer Part Number: CC0603_1UF_25V_10%_X7R; Case: 0603; Mounted: Yes; Socket: No; SMD: Yes; Sense: No; Manufacturer1 Example: MURATA; Manufacturer1 ComponentHeight: 0.9mm; HelpURL: \\cern.ch\dfs\Applications\Altium\Datasheets\CC0603_X7R_MURATA.pdf; Author: CERN DEM JLC; CreateDate: 18/01/2011; LatestRevisionDate: 18/01/2011
C33 C37 = CC0805_10UF_16V_10%_X5R: Non-polarised capacitor; Part Description: SMD Multilayer Chip Ceramic Capacitor; Manufacturer: GENERIC; Manufacturer1 Part Number: C0805C106K4PAC; Voltage: 16V; TC: X5R; Tolerance: ±10%; Part Number: CC0805_10UF_16V_10%_X5R; Component Kind: Standard; Component Type: Standard; Pin Count: 2; Value: 10uF; Status: Preferred; Manufacturer Part Number: CC0805_10UF_16V_10%_X5R; Case: 0805; Mounted: Yes; Socket: No; SMD: Yes; Manufacturer1 Example: KEMET; Manufacturer1 ComponentHeight: 1.4mm; HelpURL: \\cern.ch\dfs\Applications\Altium\Datasheets\CC1206_X5R_KEMET.pdf; Author: CERN DEM JLC; CreateDate: 03.12.2007; LatestRevisionDate: 03.12.2007; Sense: No
IC7#2 IC11 = ADP7102ARDZ-R7: 1.22V to 19V, 300mA, Low Noise, CMOS LDO Adjustable Linear Regulator; Manufacturer: ANALOG DEVICES; PressFit: No; Bonding: No; Part Number: ADP7102ARDZ-R7; Component Kind: Standard; Component Type: Standard; Device: ADP7102ARDZ-R7; PackageDescription: SOIC 8, Pitch 1.27mm - Body 3.9x4.9mm, (w/thermal tab 2.41mm X 3.098mm), IPC Medium Density; Part Description: 1.22V to 19V, 300mA, Low Noise, CMOS LDO Adjustable Linear Regulator; Manufacturer Part Number: ADP7102ARDZ-R7; Pin Count: 8; Case: SOIC8; Mounted: Yes; Socket: No; SMD: Yes; Sense: No; ComponentHeight: 1.75mm; HelpURL: \\cern.ch\dfs\Applications\Altium\Datasheets\ADP7102ARDZ-R7.pdf; Author: CERN DEM JLC; CreateDate: 16.06.2014; LatestRevisionDate: 16.06.2014
IC9 = AD4115BCPZ: Single-Supply, Multichannel, 125kSPS, 24-Bit, Sigma-Delta ADC with ±10V Inputs; Manufacturer: ANALOG DEVICES; PressFit: No; Bonding: No; Part Number: AD4115BCPZ; Component Kind: Standard; Component Type: Standard; Device: AD4115BCPZ; PackageDescription: QFN, 0.50mm Pitch, Square; 40 Pin, 6.00mm L X 6.00mm W X 1.00mm H body (w/Thermal Tab 4.70 x 4.70mm), IPC Medium Density; Part Description: Single-Supply, Multichannel, 125kSPS, 24-Bit, Sigma-Delta ADC with ±10V Inputs; Manufacturer Part Number: AD4115BCPZ; Pin Count: 41; Case: QFN40; Mounted: Yes; Socket: No; SMD: Yes; Sense: No; ComponentHeight: 1.0mm; Author: CERN DEM BC; HelpURL: \\cern.ch\dfs\Applications\Altium\Datasheets\AD4115BCPZ.pdf; CreateDate: 30.10.2020; LatestRevisionDate: 30.10.2020
IC10 = ADR4525ARZ: 2.5V Output, 1mV ±0.04% Accuracy, 4ppm/°C Ultralow Noise, High Accuracy Voltage References; Manufacturer: ANALOG DEVICES; PressFit: No; Bonding: No; Part Number: ADR4525ARZ; Component Kind: Standard; Component Type: Standard; Device: ADR4525ARZ; PackageDescription: SOIC 8, Pitch 1.27mm, Body 4x5mm, IPC Medium Density; Part Description: 2.5V Output, 1mV ±0.04% Accuracy, 4ppm/°C Ultralow Noise, High Accuracy Voltage References; Manufacturer Part Number: ADR4525ARZ; Pin Count: 8; Case: SOIC8; Mounted: Yes; Socket: No; SMD: Yes; Sense: No; ComponentHeight: 1.75mm; HelpURL: \\cern.ch\dfs\Applications\Altium\Datasheets\ADR4525ARZ.pdf; Author: CERN DEM BC; CreateDate: 19.06.2020; LatestRevisionDate: 19.06.2020
R31#2 R35-R39 = R0402_49R9_1%_0.0625W_100PPM: as R21#1 on sheet AFE_CTRL_Logic; Part Number: R0402_49R9_1%_0.0625W_100PPM; Component Kind: Standard; Component Type: Standard; Pin Count: 2; Value: 49R9; Status: Not Recommended; Power: 0.0625W; Tolerance: ±1%; Manufacturer Part Number: R0402_49R9_1%_0.0625W_100PPM; Case: 0402; Mounted: Yes; Sense: No; Socket: No; SMD: Yes; Manufacturer1 Example: YAGEO PHYCOMP; Manufacturer1 ComponentHeight: 0.4mm; HelpURL: \\cern.ch\dfs\Applications\Altium\Datasheets\R0402_Phycomp_RC0402.pdf; Author: CERN DEM JLC; CreateDate: 24.10.2012; LatestRevisionDate: 24.10.2012
R40 R56 = R0402_33R_1%_0.0625W_100PPM: Resistor - 1%; Part Description: General Purpose Thick Film Chip Resistor; Manufacturer: GENERIC; Manufacturer1 Part Number: 232270673309L; TC: ±100ppm/°C; PressFit: No; Part Number: R0402_33R_1%_0.0625W_100PPM; Component Kind: Standard; Component Type: Standard; Pin Count: 2; Value: 33; Status: Not Recommended; Power: 0.0625W; Tolerance: ±1%; Manufacturer Part Number: R0402_33R_1%_0.0625W_100PPM; Case: 0402; Mounted: Yes; Sense: No; Socket: No; SMD: Yes; Manufacturer1 Example: YAGEO PHYCOMP; Manufacturer1 ComponentHeight: 0.4mm; HelpURL: \\cern.ch\dfs\Applications\Altium\Datasheets\R0402_Phycomp_RC0402.pdf; Author: CERN DEM JLC; CreateDate: 03/12/2007; LatestRevisionDate: 17/10/2012
R41 = R0402_51K_1%_0.0625W_100PPM: Resistor - 1%; Part Description: General Purpose Thick Film Chip Resistor; Manufacturer: GENERIC; Manufacturer1 Part Number: 232270674703L; TC: ±100ppm/°C; PressFit: No; Part Number: R0402_51K_1%_0.0625W_100PPM; Component Kind: Standard; Component Type: Standard; Pin Count: 2; Value: 51k; Status: Not Recommended; Power: 0.0625W; Manufacturer Part Number: R0402_51K_1%_0.0625W_100PPM; Case: 0402; Mounted: Yes; Sense: No; Socket: No; SMD: Yes; Manufacturer1 Example: YAGEO PHYCOMP; Manufacturer1 ComponentHeight: 0.4mm; HelpURL: \\cern.ch\dfs\Applications\Altium\Datasheets\R0402_Phycomp_RC0402.pdf; Author: CERN DEM JLC; CreateDate: 03.12.2007; LatestRevisionDate: 17.10.2012
R42 = R0402_30K_1%_0.0625W_100PPM: Resistor - 1%; Part Description: General Purpose Thick Film Chip Resistor; Manufacturer: GENERIC; Manufacturer1 Part Number: 232270673003L; TC: ±100ppm/°C; PressFit: No; Part Number: R0402_30K_1%_0.0625W_100PPM; Component Kind: Standard; Component Type: Standard; Pin Count: 2; Value: 30k; Status: Not Recommended; Power: 0.0625W; Manufacturer Part Number: R0402_30K_1%_0.0625W_100PPM; Case: 0402; Mounted: Yes; Sense: No; Socket: No; SMD: Yes; Manufacturer1 Example: YAGEO PHYCOMP; Manufacturer1 ComponentHeight: 0.4mm; HelpURL: \\cern.ch\dfs\Applications\Altium\Datasheets\R0402_Phycomp_RC0402.pdf; Author: CERN DEM JLC; CreateDate: 03.12.2007; LatestRevisionDate: 17.10.2012
R57 = R0402_62K_1%_0.0625W_100PPM: Resistor - 1%; Part Description: General Purpose Thick Film Chip Resistor; Manufacturer: GENERIC; Manufacturer1 Part Number: 232270676203L; TC: ±100ppm/°C; PressFit: No; Part Number: R0402_62K_1%_0.0625W_100PPM; Component Kind: Standard; Component Type: Standard; Pin Count: 2; Value: 62k; Status: Not Recommended; Power: 0.0625W; Manufacturer Part Number: R0402_62K_1%_0.0625W_100PPM; Case: 0402; Mounted: Yes; Sense: No; Socket: No; SMD: Yes; Manufacturer1 Example: YAGEO PHYCOMP; Manufacturer1 ComponentHeight: 0.4mm; HelpURL: \\cern.ch\dfs\Applications\Altium\Datasheets\R0402_Phycomp_RC0402.pdf; Author: CERN DEM JLC; CreateDate: 03.12.2007; LatestRevisionDate: 17.10.2012
R58 = R0402_20K_1%_0.0625W_100PPM: Resistor - 1%; Part Description: General Purpose Thick Film Chip Resistor; Manufacturer: GENERIC; Manufacturer1 Part Number: 232270672003L; TC: ±100ppm/°C; PressFit: No; Part Number: R0402_20K_1%_0.0625W_100PPM; Component Kind: Standard; Component Type: Standard; Pin Count: 2; Value: 20k; Status: Not Recommended; Power: 0.0625W; Manufacturer Part Number: R0402_20K_1%_0.0625W_100PPM; Case: 0402; Mounted: Yes; Sense: No; Socket: No; SMD: Yes; Manufacturer1 Example: YAGEO PHYCOMP; Manufacturer1 ComponentHeight: 0.4mm; HelpURL: \\cern.ch\dfs\Applications\Altium\Datasheets\R0402_Phycomp_RC0402.pdf; Author: CERN DEM JLC; CreateDate: 03.12.2007; LatestRevisionDate: 17.10.2012
R73-R76 = R0402_10K_1%_0.0625W_100PPM: as R69 on sheet AFE_CTRL_Logic; Part Number: R0402_10K_1%_0.0625W_100PPM; Component Kind: Standard; Component Type: Standard; Pin Count: 2; Value: 10k; Status: Not Recommended; Power: 0.0625W; Manufacturer Part Number: R0402_10K_1%_0.0625W_100PPM; Case: 0402; Mounted: Yes; Sense: No; Socket: No; SMD: Yes; Manufacturer1 Example: YAGEO PHYCOMP; Manufacturer1 ComponentHeight: 0.4mm; HelpURL: \\cern.ch\dfs\Applications\Altium\Datasheets\R0402_Phycomp_RC0402.pdf; Author: CERN DEM JLC; CreateDate: 03.12.2007; LatestRevisionDate: 17.10.2012

## Nets that join several sheets
GND: Shuttler_AFE (27 pins), AFE_CTRL_Logic (34 pins), AFE_ADC (35 pins)
P3V3: AFE_CTRL_Logic (14 pins), AFE_ADC (R73.1 R75.1)
P3V3A: Shuttler_AFE (R6.1), AFE_ADC (8 pins)
P13V0A: Shuttler_AFE (R43.1), AFE_ADC (C14.1 IC10.2)

## Assembly variants
std: not fitted R69 R70 R71 R72 R73 R74 R75 R76 RL1A RL1B RL1C RL1D RL1E RL1F RL1G RL1H RL2A RL2B RL2C RL2D RL2E RL2F RL2G RL2H